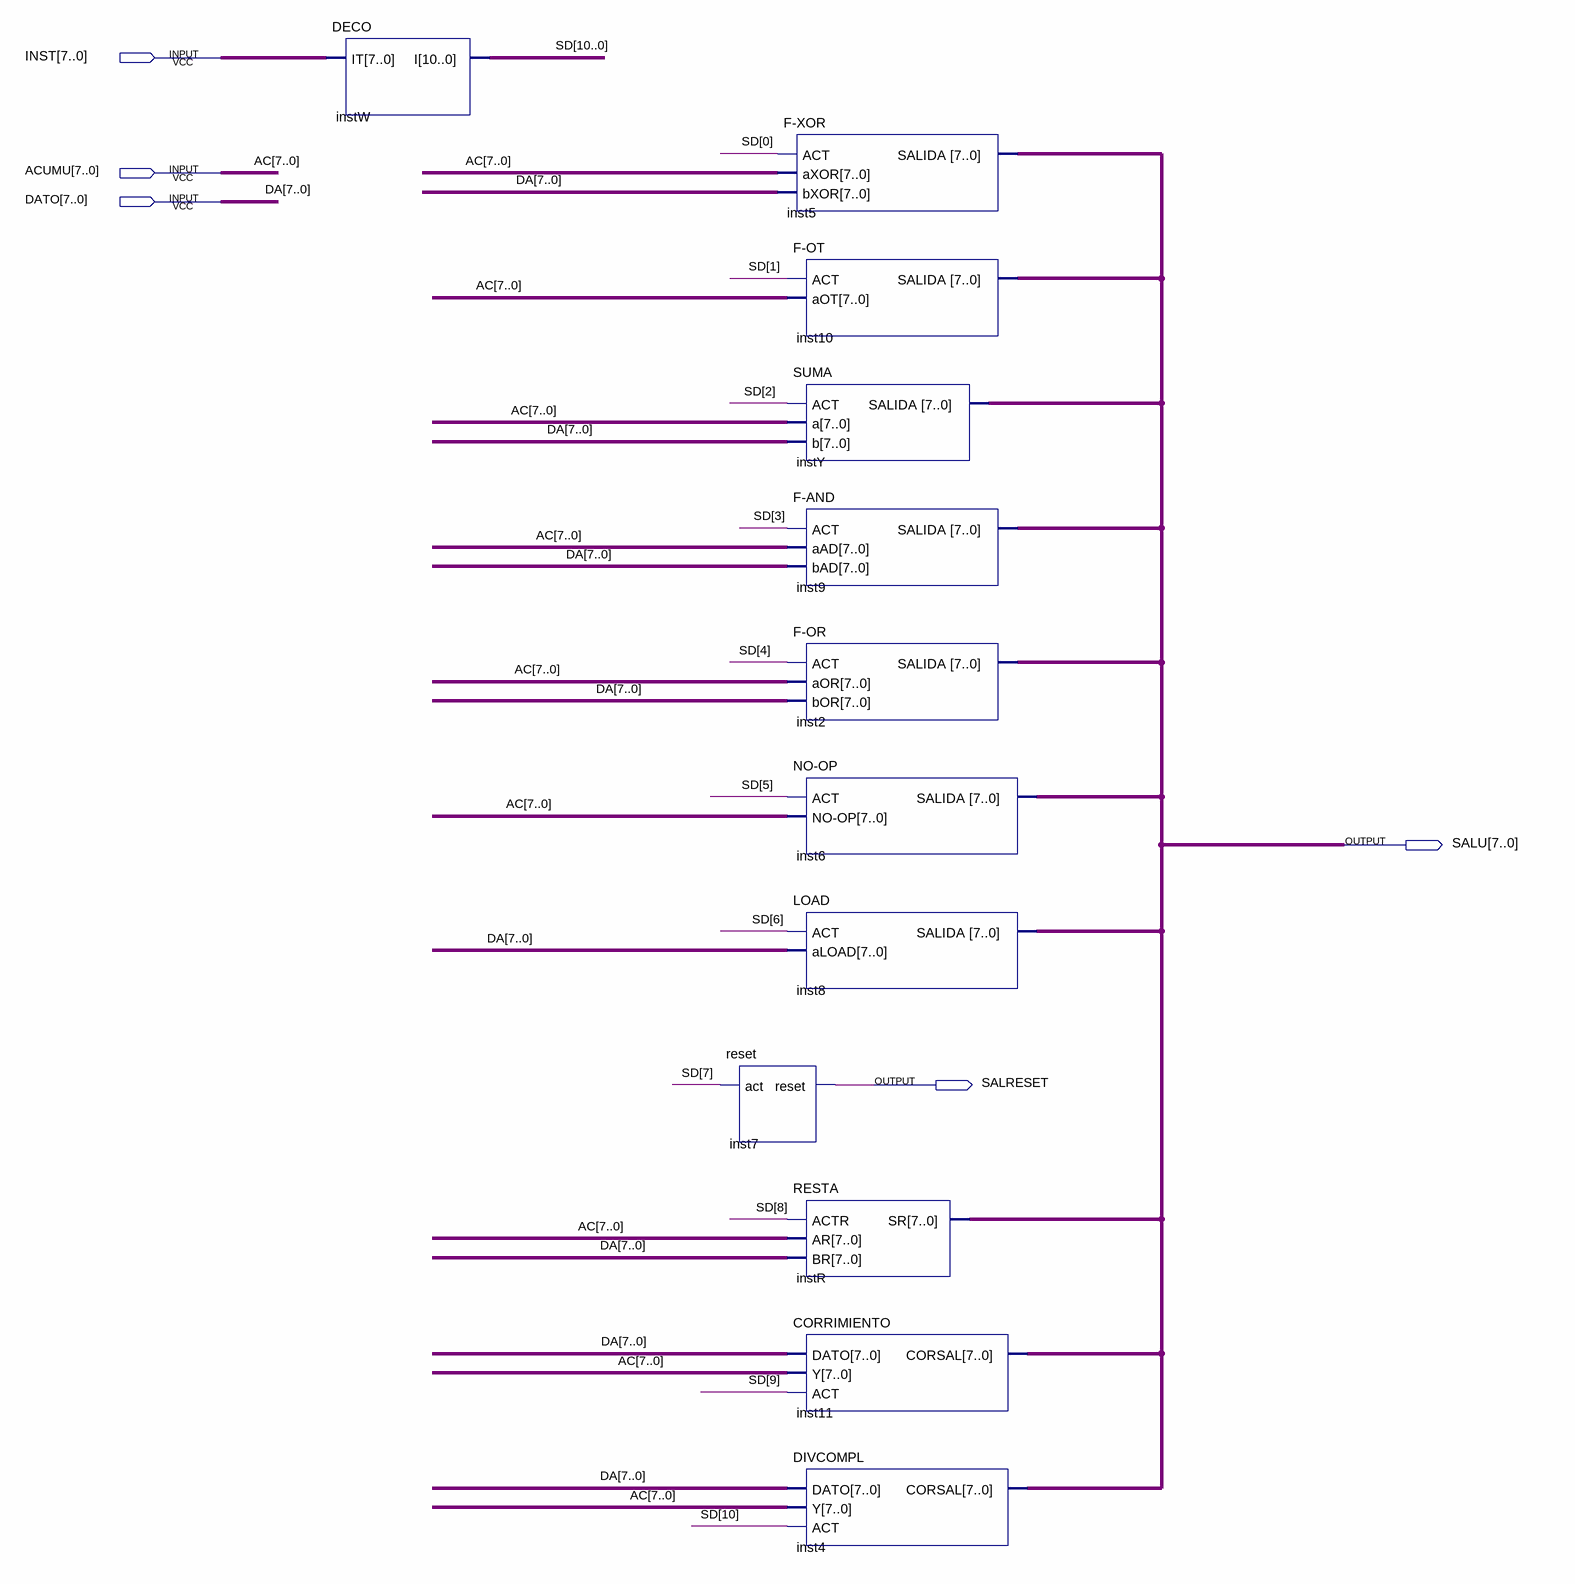
[diagram p0: schematic sheet]
// Quartus schematic ALU.bdf as structural Verilog: 12 symbols, 5 pins
module ALU (
  input  [7:0] INST,
  input  [7:0] ACUMU,
  input  [7:0] DATO,
  output [7:0] SALU,
  output SALRESET
);

  wire [10:0] SD;

  DECO instW (.IT(INST), .I(SD));
  \F-XOR  inst5 (.ACT(SD[0]), .aXOR(ACUMU), .bXOR(DATO), .SALIDA(SALU));
  reset inst7 (.act(SD[7]), .reset(SALRESET));
  \F-OT  inst10 (.ACT(SD[1]), .aOT(ACUMU), .SALIDA(SALU));
  SUMA instY (.ACT(SD[2]), .a(ACUMU), .b(DATO), .SALIDA(SALU));
  \F-AND  inst9 (.ACT(SD[3]), .aAD(ACUMU), .bAD(DATO), .SALIDA(SALU));
  \F-OR  inst2 (.ACT(SD[4]), .aOR(ACUMU), .bOR(DATO), .SALIDA(SALU));
  \NO-OP  inst6 (.ACT(SD[5]), .\NO-OP (ACUMU), .SALIDA(SALU));
  LOAD inst8 (.ACT(SD[6]), .aLOAD(DATO), .SALIDA(SALU));
  RESTA instR (.ACTR(SD[8]), .AR(ACUMU), .BR(DATO), .SR(SALU));
  CORRIMIENTO inst11 (.DATO(DATO), .Y(ACUMU), .ACT(SD[9]), .CORSAL(SALU));
  DIVCOMPL inst4 (.DATO(DATO), .Y(ACUMU), .ACT(SD[10]), .CORSAL(SALU));

  // Other names for the same wires on the sheet: AC[7:0] = ACUMU; DA[7:0] = DATO
endmodule
